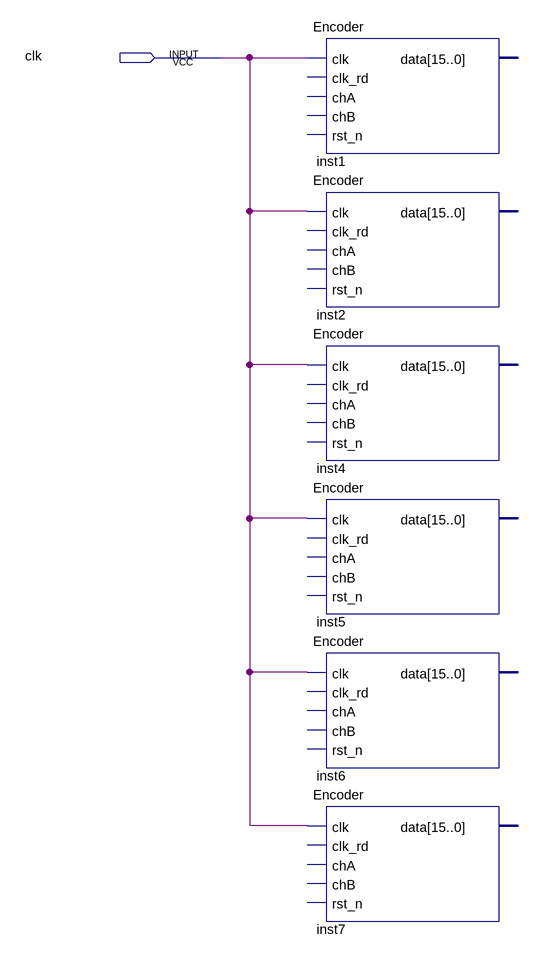
[diagram p0: schematic sheet]
// Quartus schematic block_name.bdf as structural Verilog: 6 symbols, 1 pins
module block_name (
  input  clk
);

  Encoder inst1 (.clk(clk));  // open: clk_rd, chA, chB, rst_n, data
  Encoder inst2 (.clk(clk));  // open: clk_rd, chA, chB, rst_n, data
  Encoder inst4 (.clk(clk));  // open: clk_rd, chA, chB, rst_n, data
  Encoder inst5 (.clk(clk));  // open: clk_rd, chA, chB, rst_n, data
  Encoder inst6 (.clk(clk));  // open: clk_rd, chA, chB, rst_n, data
  Encoder inst7 (.clk(clk));  // open: clk_rd, chA, chB, rst_n, data
endmodule
